# Altium project BSPD_Main.PrjPcb
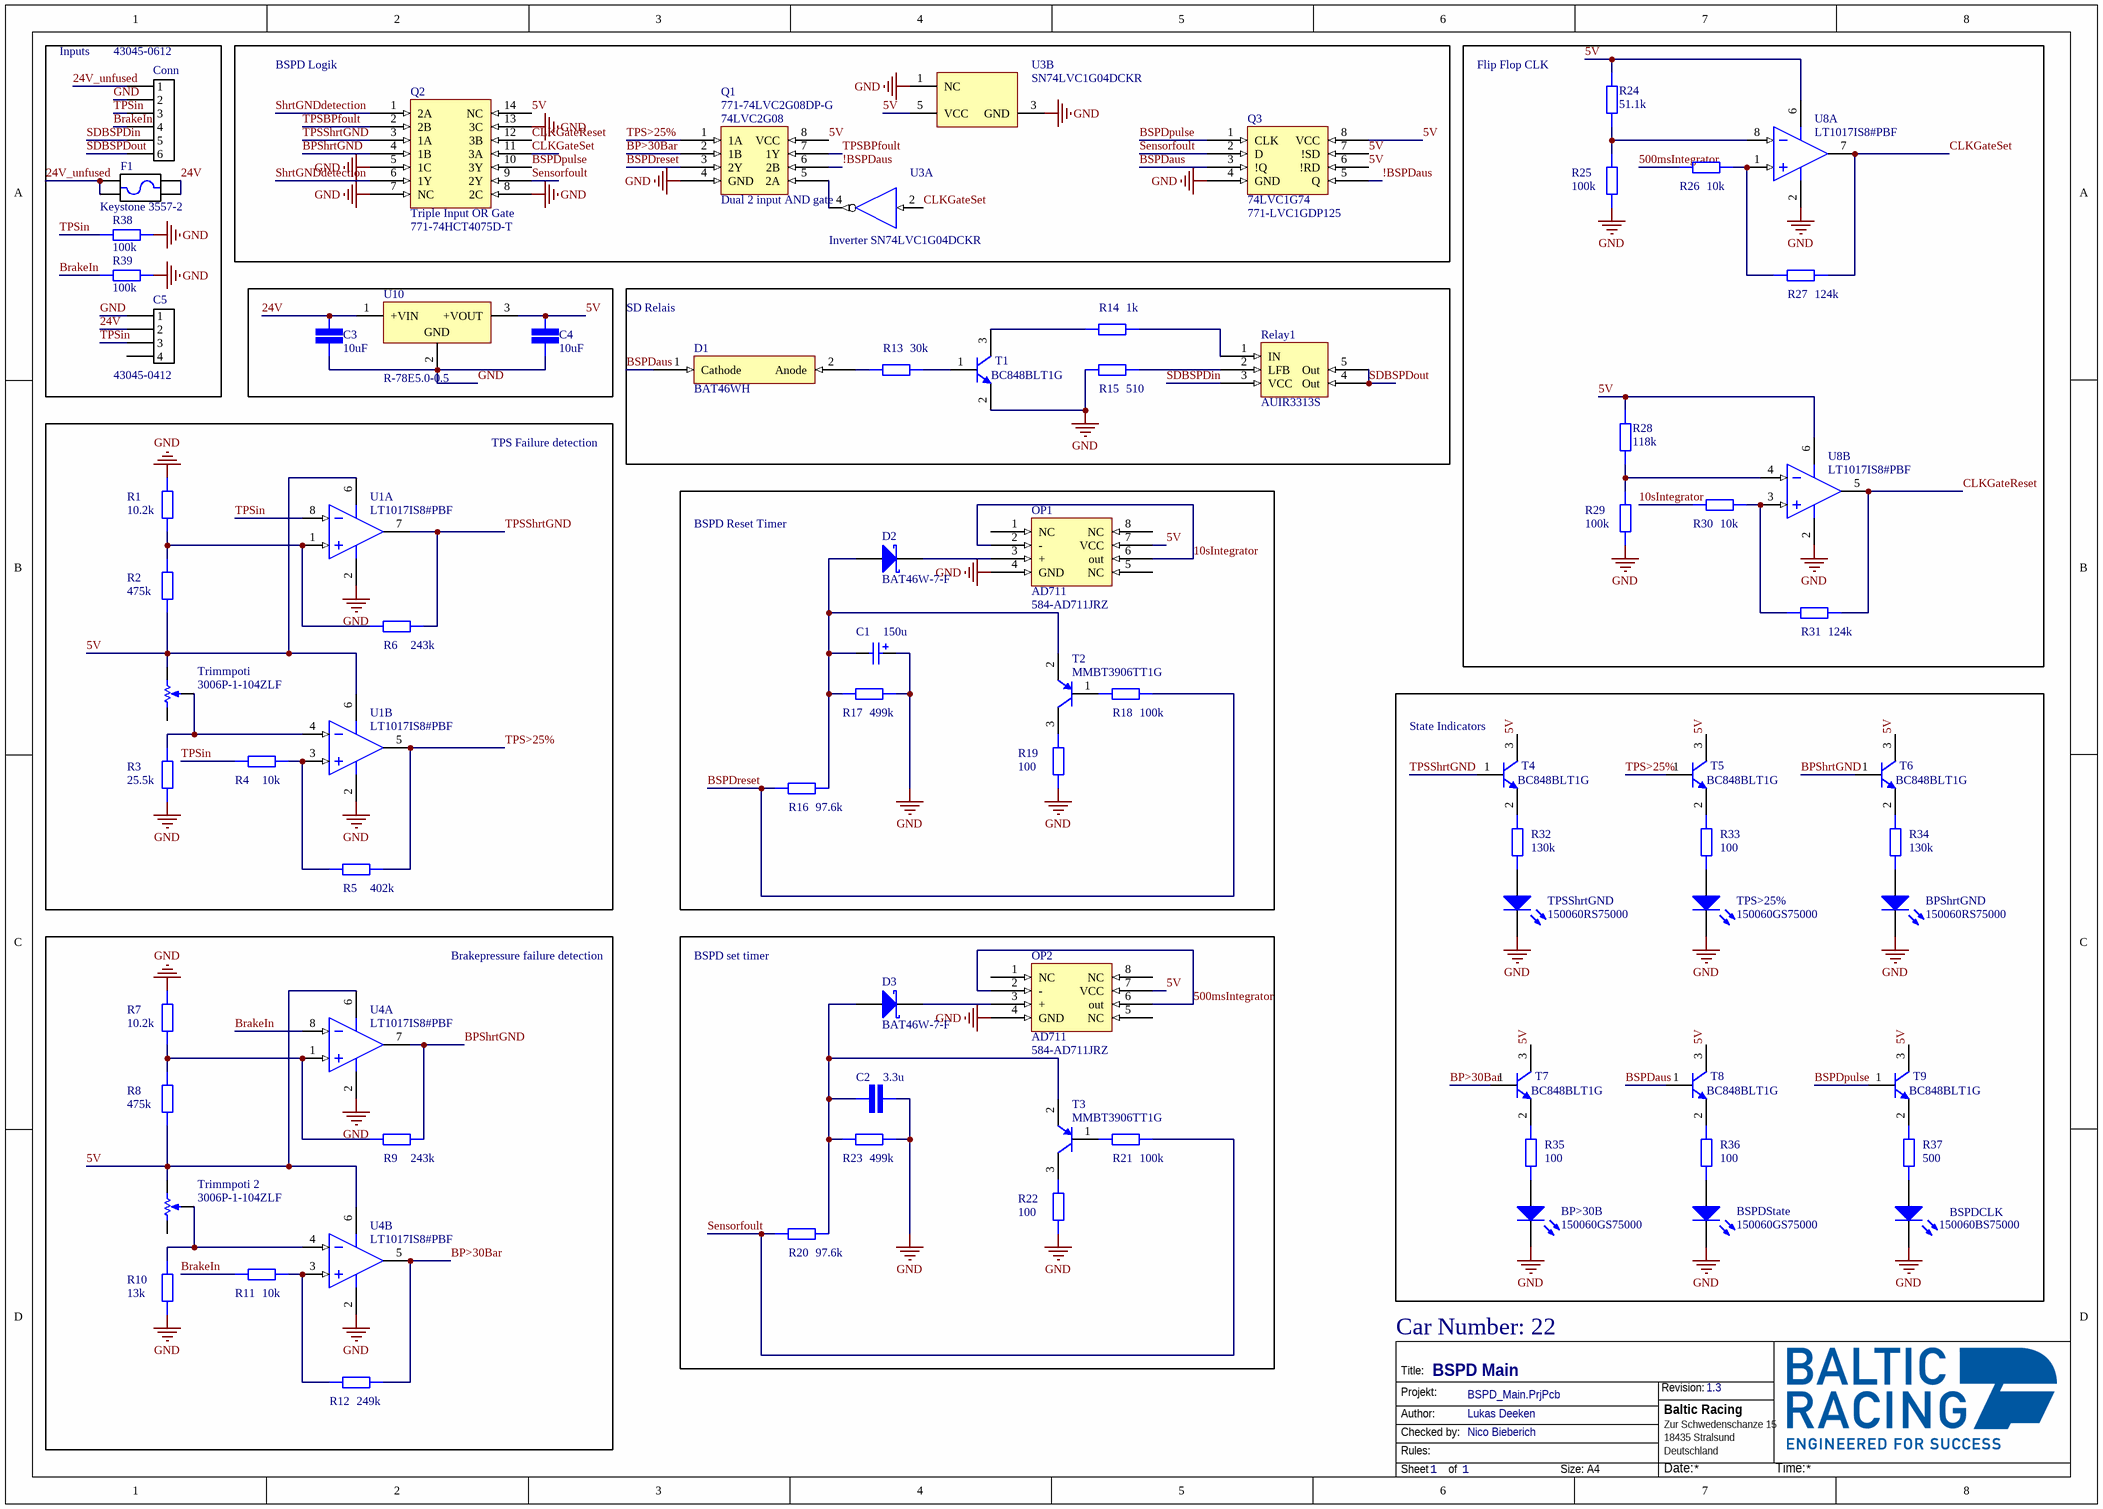
[diagram p0: SCH_BSPD_Main.SchDoc]
1 sheet, 77 parts. Net scope: global (net labels, ports and power ports of the same name join across sheets).
Board file: PCB_BSPD_Main.PcbDoc

## Sheet SCH_BSPD_Main.SchDoc: BSPD Main
size A3; Date: 25.03.2022; CheckedBy: Nico Bieberich; Author: Lukas Deeken; CompanyName: Baltic racing; DrawnBy: Lukas Deeken; Engineer: Lukas Deeken*; Organization: Baltic Racing; Address1: Zur Schwedenschanze 15; Address2: 18435 Stralsund; Address3: Deutschland; DocumentNumber: 1; Revision: 1.3; SheetNumber: 1; SheetTotal: 1

### Parts
BP>30B  150060GS75000  [0603_A]
BPShrtGND  150060RS75000  [0603_A]
BSPDCLK  150060BS75000  [0603_A]
BSPDState  150060GS75000  [0603_A]
C1  value 150u  [WCAP-PSLC_10x12.4]  (hidden comment: 875075561006)
C2  value 3.3u  [CAP 0603/1608]  (hidden comment: SMD Capacitor)
C3  value 10uF  [CAP 0805/2012]  (hidden comment: SMD Capacitor)
C4  value 10uF  [CAP 0805/2012]  (hidden comment: SMD Capacitor)
C5  43045-0412  [43045-0412]
Conn  43045-0612  [43045-0612]
D1  BAT46WH  [DIOM2715X18N]
D2  BAT46W-7-F  [DIOD-SOD-123-2_V]
D3  BAT46W-7-F  [DIOD-SOD-123-2_V]
F1  Keystone 3557-2  [Keystone 3557-2]
OP1  AD711  Supplier Part Number 1: 584-AD711JRZ  [SOIC8; SOIC127P600X175-8N]
OP2  AD711  Supplier Part Number 1: 584-AD711JRZ  [SOIC8; SOIC127P600X175-8N]
Q1  Dual 2 input AND gate  Supplier Part Number 1: 771-74LVC2G08DP-G  [TSSOP8; TSOP65P400X110-8N]
Q2  Triple Input OR Gate  Supplier Part Number 1: 771-74HCT4075D-T  [SOIC14; SOIC127P600X175-14N]
Q3  74LVC1G74  Supplier Part Number 1: 771-LVC1GDP125  [TSSOP8; TSOP65P400X110-8N]
R1  value 10.2k  [STACKPOLE CSR0603]  (hidden comment: SMD Resistor)
R2  value 475k  [STACKPOLE CSR0603]  (hidden comment: SMD Resistor)
R3  value 25.5k  [STACKPOLE CSR0603]  (hidden comment: SMD Resistor)
R4  value 10k  [STACKPOLE CSR0603]  (hidden comment: SMD Resistor)
R5  value 402k  [STACKPOLE CSR0603]  (hidden comment: SMD Resistor)
R6  value 243k  [STACKPOLE CSR0603]  (hidden comment: SMD Resistor)
R7  value 10.2k  [STACKPOLE CSR0603]  (hidden comment: SMD Resistor)
R8  value 475k  [STACKPOLE CSR0603]  (hidden comment: SMD Resistor)
R9  value 243k  [STACKPOLE CSR0603]  (hidden comment: SMD Resistor)
R10  value 13k  [STACKPOLE CSR0603]  (hidden comment: SMD Resistor)
R11  value 10k  [STACKPOLE CSR0603]  (hidden comment: SMD Resistor)
R12  value 249k  [STACKPOLE CSR0603]  (hidden comment: SMD Resistor)
R13  value 30k  [STACKPOLE CSR0603]  (hidden comment: SMD Resistor)
R14  value 1k  [STACKPOLE CSR0805]  (hidden comment: SMD Resistor)
R15  value 510  [STACKPOLE CSR0603]  (hidden comment: SMD Resistor)
R16  value 97.6k  [STACKPOLE CSR0603]  (hidden comment: SMD Resistor)
R17  value 499k  [STACKPOLE CSR0603]  (hidden comment: SMD Resistor)
R18  value 100k  [STACKPOLE CSR0603]  (hidden comment: SMD Resistor)
R19  value 100  [STACKPOLE CSR0805]  (hidden comment: SMD Resistor)
R20  value 97.6k  [STACKPOLE CSR0603]  (hidden comment: SMD Resistor)
R21  value 100k  [STACKPOLE CSR0603]  (hidden comment: SMD Resistor)
R22  value 100  [STACKPOLE CSR0805]  (hidden comment: SMD Resistor)
R23  value 499k  [STACKPOLE CSR0603]  (hidden comment: SMD Resistor)
R24  value 51.1k  [STACKPOLE CSR0603]  (hidden comment: SMD Resistor)
R25  value 100k  [STACKPOLE CSR0603]  (hidden comment: SMD Resistor)
R26  value 10k  [STACKPOLE CSR0603]  (hidden comment: SMD Resistor)
R27  value 124k  [STACKPOLE CSR0603]  (hidden comment: SMD Resistor)
R28  value 118k  [STACKPOLE CSR0603]  (hidden comment: SMD Resistor)
R29  value 100k  [STACKPOLE CSR0603]  (hidden comment: SMD Resistor)
R30  value 10k  [STACKPOLE CSR0603]  (hidden comment: SMD Resistor)
R31  value 124k  [STACKPOLE CSR0603]  (hidden comment: SMD Resistor)
R32  value 130k  [STACKPOLE CSR0603]  (hidden comment: SMD Resistor)
R33  value 100  [STACKPOLE CSR0603]  (hidden comment: SMD Resistor)
R34  value 130k  [STACKPOLE CSR0603]  (hidden comment: SMD Resistor)
R35  value 100  [STACKPOLE CSR0603]  (hidden comment: SMD Resistor)
R36  value 100  [STACKPOLE CSR0603]  (hidden comment: SMD Resistor)
R37  value 500  [STACKPOLE CSR0603]  (hidden comment: SMD Resistor)
R38  value 100k  [STACKPOLE CSR0603]  (hidden comment: SMD Resistor)
R39  value 100k  [STACKPOLE CSR0603]  (hidden comment: SMD Resistor)
Relay1  AUIR3313S  [D2PAK5 ;DPAK228P1524X483-5N]
T1  BC848BLT1G  [ONSC-SOT-23-3-318-08_V]
T2  MMBT3906TT1G  [ONSC-SC-75-3-463-01_V]
T3  MMBT3906TT1G  [ONSC-SC-75-3-463-01_V]
T4  BC848BLT1G  [ONSC-SOT-23-3-318-08_V]
T5  BC848BLT1G  [ONSC-SOT-23-3-318-08_V]
T6  BC848BLT1G  [ONSC-SOT-23-3-318-08_V]
T7  BC848BLT1G  [ONSC-SOT-23-3-318-08_V]
T8  BC848BLT1G  [ONSC-SOT-23-3-318-08_V]
T9  BC848BLT1G  [ONSC-SOT-23-3-318-08_V]
TPS>25%  150060GS75000  [0603_A]
TPSShrtGND  150060RS75000  [0603_A]
Trimmpoti  3006P-1-104ZLF  [BOUR-3006P-3_V]
Trimmpoti_2  3006P-1-104ZLF  [BOUR-3006P-3_V]
U1  LT1017IS8#PBF  [LT-S8_N]  (parts A,B of 2)
U3  Inverter SN74LVC1G04DCKR  [DCK0005A_N]  (parts A,B of 2)
U4  LT1017IS8#PBF  [LT-S8_N]  (parts A,B of 2)
U8  LT1017IS8#PBF  [LT-S8_N]  (parts A,B of 2)
U10  R-78E5.0-0.5  [REPO-R-78E-0.5-3_V]

### Blocks framed on the sheet
Inputs: C5 Conn F1 R38 R39
BSPD Logik: Q1-Q3 U3
Flip Flop CLK: R24-R31 U8
SD Relais: D1 R13-R15 Relay1 T1
TPS Failure detection: R1-R6 Trimmpoti U1
BSPD Reset Timer: C1 D2 OP1 R16-R19 T2
State Indicators: BP>30B BPShrtGND BSPDCLK BSPDState R32-R37 T4-T9 TPS>25% TPSShrtGND
Brakepressure failure detection: R7-R12 Trimmpoti_2 U4
BSPD set timer: C2 D3 OP2 R20-R23 T3

### Nets
GND: BP>30B.1(K) BPShrtGND.1(K) BSPDCLK.1(K) BSPDState.1(K) C1.1(P) C2.1 C3.1 C4.1 C5.1 Conn.2 OP1.4(GND) OP2.4(GND) Q1.4(GND) Q2.5(1C) Q2.7(NC) Q2.8(2C) Q2.13(3C) Q3.4(GND) R1.1 R3.2 R7.1 R10.2 R15.1 R17.2 R19.1 R22.1 R23.2 R25.2 R29.2 R38.2 R39.2 T1.2(E) TPS>25%.1(K) TPSShrtGND.1(K) U1.2(V-) U3.1(NC) U3.3(GND) U4.2(V-) U8.2(V-) U10.2(GND)
5V: C4.2 OP1.7(VCC) OP2.7(VCC) Q1.8(VCC) Q2.14(NC) Q3.6(!RD) Q3.7(!SD) Q3.8(VCC) R2.2 R8.2 R24.2 R28.2 T4.3(C) T5.3(C) T6.3(C) T7.3(C) T8.3(C) T9.3(C) Trimmpoti.1(CCW) Trimmpoti_2.1(CCW) U1.6(V+) U3.5(VCC) U4.6(V+) U8.6(V+) U10.3(+VOUT)
10sIntegrator: OP1.2(-) OP1.6(out) R30.2
24V: C3.2 C5.2 F1.O1 F1.O2 U10.1(+VIN)
24V_unfused: Conn.1 F1.I1 F1.I2
500msIntegrator: OP2.2(-) OP2.6(out) R26.2
!BSPDaus: Q1.6(2B) Q3.5(Q)
BP>30Bar: Q1.2(1B) R12.2 T7.1(B) U4.5(OUT_B)
BPShrtGND: Q2.4(1B) R9.1 T6.1(B) U4.7(OUT_A)
BrakeIn: Conn.4 R11.2 R39.1 U4.8(-IN_A)
BSPDaus: D1.1(Cathode) Q3.3(!Q) T8.1(B)
BSPDpulse: Q2.10(3Y) Q3.1(CLK) T9.1(B)
BSPDreset: Q1.3(2Y) R16.1 R18.2
CLKGateReset: Q2.12(3B) R31.2 U8.5(OUT_B)
CLKGateSet: Q2.11(3A) R27.2 U3.2(A) U8.7(OUT_A)
SDBSPDin: Conn.5 Relay1.3(VCC)
SDBSPDout: Conn.6 Relay1.4(Out) Relay1.5(Out)
Sensorfoult: Q2.9(2Y) Q3.2(D) R20.1 R21.2
ShrtGNDdetection: Q2.1(2A) Q2.6(1Y)
TPS>25%: Q1.1(1A) R5.1 T5.1(B) U1.5(OUT_B)
TPSBPfoult: Q1.7(1Y) Q2.2(2B)
TPSin: C5.3 Conn.3 R4.2 R38.1 U1.8(-IN_A)
TPSShrtGND: Q2.3(1A) R6.1 T4.1(B) U1.7(OUT_A)
NetBP>30B_2: BP>30B.2(A) R35.1
NetBPShrtGND_2: BPShrtGND.2(A) R34.1
NetBSPDCLK_2: BSPDCLK.2(A) R37.1
NetBSPDState_2: BSPDState.2(A) R36.1
NetC1_2: C1.2(N) D2.1(A) R16.2 R17.1 T2.2(E)
NetC2_2: C2.2 D3.1(A) R20.2 R23.1 T3.2(E)
NetD1_2: D1.2(Anode) R13.1
NetD2_2: D2.2(K) OP1.3(+)
NetD3_2: D3.2(K) OP2.3(+)
NetQ1_5: Q1.5(2A) U3.4(Y)
NetR1_2: R1.2 R2.1 R6.2 U1.1(+IN_A)
NetR3_1: R3.1 Trimmpoti.2(WIPER) U1.4(-IN_B)
NetR4_1: R4.1 R5.2 U1.3(+IN_B)
NetR7_2: R7.2 R8.1 R9.2 U4.1(+IN_A)
NetR10_1: R10.1 Trimmpoti_2.2(WIPER) U4.4(-IN_B)
NetR11_1: R11.1 R12.1 U4.3(+IN_B)
NetR13_2: R13.2 T1.1(B)
NetR14_1: R14.1 T1.3(C)
NetR14_2: R14.2 Relay1.1(IN)
NetR15_2: R15.2 Relay1.2(LFB)
NetR18_1: R18.1 T2.1(B)
NetR19_2: R19.2 T2.3(C)
NetR21_1: R21.1 T3.1(B)
NetR22_2: R22.2 T3.3(C)
NetR24_1: R24.1 R25.1 U8.8(-IN_A)
NetR26_1: R26.1 R27.1 U8.1(+IN_A)
NetR28_1: R28.1 R29.1 U8.4(-IN_B)
NetR30_1: R30.1 R31.1 U8.3(+IN_B)
NetR32_1: R32.1 TPSShrtGND.2(A)
NetR32_2: R32.2 T4.2(E)
NetR33_1: R33.1 TPS>25%.2(A)
NetR33_2: R33.2 T5.2(E)
NetR34_2: R34.2 T6.2(E)
NetR35_2: R35.2 T7.2(E)
NetR36_2: R36.2 T8.2(E)
NetR37_2: R37.2 T9.2(E)

Not connected (* = marked no-connect by the designer): C5 4; OP1 1(NC) 5(NC) 8(NC); OP2 1(NC) 5(NC) 8(NC); Trimmpoti 3(CW); Trimmpoti_2 3(CW)

### Notes on the sheet
- Car Number: 22
- Title:
- Projekt:
- Revision:
- Author:
- Rules:
- Checked by:
- Sheet
- of
- Size:
- A4
- Date:
- Time:
- (in symbol 74LVC2G08-Q100) 74LVC2G08

### Library data of the parts
BP>30B BSPDState TPS>25% = CMP-1426-00002-1: SMD mono-color Chip LED, WL-SMCW, Green; Manufacturer: Wuerth Elektronik; ComponentLink1URL: http://www.we-online.com; ComponentLink2Description: Datasheet; Color: Green; ComponentLink2URL: http://katalog.we-online.com/led/datasheet/150060GS75000.pdf; PartNumber: 150060GS75000; PackageReference: 0603_A; ComponentLink1Description: Manufacturer URL
BPShrtGND TPSShrtGND = CMP-1426-00001-1: SMD mono-color Chip LED, WL-SMCW, Red; Manufacturer: Wuerth Elektronik; Color: Red; PackageReference: 0603_A; ComponentLink2URL: http://katalog.we-online.com/led/datasheet/150060RS75000.pdf; ComponentLink1URL: http://www.we-online.com; ComponentLink1Description: Manufacturer URL; ComponentLink2Description: Datasheet; PartNumber: 150060RS75000
BSPDCLK = CMP-1426-00003-1: SMD mono-color Chip LED, WL-SMCW, Blue; Manufacturer: Wuerth Elektronik; Color: Blue; ComponentLink2Description: Datasheet; ComponentLink2URL: http://katalog.we-online.com/led/datasheet/150060BS75000.pdf; ComponentLink1URL: http://www.we-online.com; PackageReference: 0603_A; PartNumber: 150060BS75000; ComponentLink1Description: Manufacturer URL
C1 = 875075561006: WCAP-PSLC Aluminum Polymer Capacitors, size Ф10x12.4mm, 25V DC, 150uF; Rated Voltage: 25V DC; ComponentLink1Description: Manufacturer; ComponentLink1URL: http://www.we-online.de; ComponentLink2Description: Datasheet; ComponentLink2URL: http://katalog.we-online.de/pbs/datasheet/875075561006.pdf; Part Number: 875075561006; Published Date: June 2017; Publisher: Wurth Elektronik; Size: Ф10x12.4mm; Life Cycle: 2000h; Operating Temperature: -55 °C up to +105 °C
C2 C4 = SMD Capacitor: Capacitor with multiple Footprints; Voltage: 6.3V
C3 = SMD Capacitor: Capacitor with multiple Footprints; Voltage: 25V
C5 = MicroFit3.0 4-Pin: Molex Micro-Fit 3.0 4-Pin / 600V / 8.5A
Conn = MicroFit3.0 6-Pin: Molex Micro-Fit 3.0 6-Pin / 600V / 8.5A
D2 D3 = CMP-0303-00004-1: Surface Mount Schottky Barrier Diode, 100 V, -55 to 125 degC, 2-Pin SOD123, RoHS, Tape and Reel; Manufacturer: Diodes Inc; IR@1.5 V: 0.3 uA Max.; V(BR)R: 100 V Min.; VF@10 mA: 0.45 V Max.; CT@1 V: 12 pF Typ.; PartNumber: BAT46W-7-F; ComponentLink1URL: http://www.diodes.com/; ComponentLink3URL: http://diodes.com/datasheets/ds30044.pdf; PackageDescription: 2-Pin SMD, Body 2.7 x 1.55 mm, Height 1.45 mm; ComponentLink2Description: Datasheet; ComponentLink3Description: Package Specification; Mounting Technology: Surface Mount; ComponentLink1Description: Manufacturer URL; RoHS: TRUE; Operating Temperature: -55 to 125 degC; Packing: Tape and Reel; ComponentLink2URL: http://diodes.com/datasheets/ds30044.pdf; DatasheetVersion: Rev. 16-2
F1 = Keystone 3557-2: Keystone 3557-2 / Fuse Holder; ComponentLink1Description: Octopart; ComponentLink1URL: https://octopart.com/3557-2-keystone-850400?r=sp
Q1 = 74LVC2G08-Q100: Supplier 1: Mouser
Q2 = 74HCT4075D,653: Supplier 1: Mouser
R1-R39 = SMD Resistor: Resistor with multiple footprints
T1 T4-T9 = CMP-1048-00679-1: General Purpose Transistor, NPN Silicon, 3-Pin SOT-23, Pb-Free, Tape and Reel; Manufacturer: On Semiconductor; fT Min (MHz): 100; IC Continuous (A): 0.1; DatasheetVersion: Rev. 11; PackageVersion: Rev. AP, 11/2009; RoHS: TRUE; PartNumber: BC848BLT1G; ComponentLink1Description: Manufacturer URL; PackageReference: SOT-23-3-318-08; ComponentLink3Description: Package Specification; ComponentLink1URL: http://www.onsemi.com/; Polarity: NPN; ComponentLink2Description: Datasheet; ComponentLink2URL: http://www.onsemi.cn/pub_link/Collateral/BC846ALT1-D.PDF; ComponentLink3URL: http://www.onsemi.cn/pub_link/Collateral/318-08.PDF; PackageDescription: 3-Pin Small Outline Transistor, Body 2.92 x 1.3 mm, Pitch 0.95 mm; Packing: Tape and Reel; Mounting Technology: Surface Mount
T2 T3 = CMP-1048-00413-1: General Purpose Transistor, PNP Silicon, 3-Pin SC-75, Pb-Free, Tape and Reel; Manufacturer: On Semiconductor; fT Min (MHz): 250; IC Continuous (A): -0.2; ComponentLink1URL: http://www.onsemi.com/; ComponentLink3Description: Package Specification; PackageDescription: 3-Pin Small Outline Transistor, Body 1.6 x 0.8 mm, Pitch 0.5 mm; ComponentLink1Description: Manufacturer URL; ComponentLink2Description: Datasheet; RoHS: TRUE; Packing: Tape and Reel; PackageVersion: Rev. F, 07/2005; PartNumber: MMBT3906TT1G; ComponentLink3URL: http://www.onsemi.com/pub_link/Collateral/463-01.PDF; PackageReference: SC-75-3-463-01; Mounting Technology: Surface Mount; Polarity: PNP; DatasheetVersion: Rev. 1; ComponentLink2URL: http://www.onsemi.cn/pub_link/Collateral/MMBT3906TT1-D.PDF
Trimmpoti Trimmpoti_2 = CMP-0975-00010-1: Trimming Potentiometer, 100K Ohm +/- 10%, -55 to 125 degC, 3-Pin 19.05 x 4.83 x 6.6 mm THD, RoHS; Manufacturer: Bourns; Rotational Life: 200 Cycles; Resistance Tolerance: +/- 10%; Resistance (kOhm): 100; Number of Turns: 15; ComponentLink1Description: Manufacturer URL; ComponentLink1URL: http://www.bourns.com/; ComponentLink2URL: http://www.bourns.com/data/global/pdfs/3006.pdf; DatasheetVersion: Apr-14; PartNumber: 3006P-1-104ZLF; ComponentLink3URL: http://www.bourns.com/data/global/pdfs/3006.pdf; PackageDescription: 3-Pin THD, Body 19.05 x 4.83 mm, Height 6.6 mm; Temperature Range: -55 to 125 degC; ComponentLink3Description: Package Specification; RoHS: TRUE; ComponentLink2Description: Datasheet; PackageReference: 3006P-3; PackageVersion: Apr-14; Mounting Technology: Through Hole
U1 U4 U8 = CMP-0360-00547-2: Micropower Comparator, 2 Channels, 1.2 to 40 V, -40 to +85 degC, 8-pin SOP (S8); Manufacturer: Linear Technology; Generic Part Number: LT1017; Prop Delay (us): 22; Vos (mV) Typical: 0.4; Vs Max (V): 40; Vos (mV) Guaranteed: 1; Supply Current (uA) Guaranteed: 60; Vs Min (V): 1.2; Supply Current (uA) Typical: 30; Channels (#): 2; Features: Comparator; ComponentLink1Description: Manufacturer URL; ComponentLink2Description: Datasheet; PackageDescription: 8-Pin Plastic Small Outline (Narrow .150 Inch), Body 4.9 x 3.9 mm, Pitch 1.27 mm; ComponentLink1URL: http://www.linear.com/; PartNumber: LT1017IS8#PBF; RoHS: Y; Mounting Technology: Surface Mount; DatasheetVersion: Rev F; PackageReference: S8; ComponentLink3Description: Package Specification; ComponentLink3URL: http://cds.linear.com/docs/en/packaging/05081610_G_SO8.pdf; ComponentLink2URL: http://cds.linear.com/docs/en/datasheet/10178ff.pdf; Supply Voltage Range: 1.2 to 40 V
U3 = CMP-0859-00252-3: Single Inverter, DCK0005A, LARGE T&R; Manufacturer: Texas Instruments; Input Type: CMOS/TTL; Output Drive (IOL/IOH)(Max)(mA): 32/-32; Sub-Family: Inverting Buffer/Driver; VCC(Min)(V): 1.65; Bits(#): 1; Schmitt Trigger: No; Technology Family: LVC; Rating: Catalog; ICC @ Nom Voltage(Max)(mA): 0.01; tpd @ Nom Voltage(Max)(ns): 7.5,5.2,4.2,3.7; Voltage(Nom)(V): 1.8,2.5,3.3,5; F @ Nom Voltage(Max)(Mhz): 150; Output Type: CMOS; VCC(Max)(V): 5.5; Logic: Inverting; PackageReference: DCK0005A; Generic Part Number: SN74LVC1G04; Operating Temperature Range(C): -40 to 125,-40 to 85; DatasheetVersion: SCES214AD; 3-State Output: No
U10 = CMP-2000-06922-2: DC/DC-Converter, 5 V Single Output, 500 mA, -40 to 85 degC, 3-Pin THD, RoHS, Tube; Manufacturer: Recom Power; Efficiency: 92%; Number of Outputs: 1; Current - Output (Max): 500mA; VIN Min: 7V; Package Version: Rev. 0; VIN Max: 28V; VOUT: 5V; Manufacturer URL: http://www.recom-power.com/us/americas/home.html; Operating Temperature: -40°C~85°C; Datasheet Version: 01/2017; Packaging: Tube; Package Reference: SIP Module; Datasheet URL: http://www.recom-power.com/pdf/Innoline/R-78Exx-0.5.pdf; Package Description: 3-Pin Through Hole Device, Body 11.6 x 8.5 mm, Pitch 2.54 mm; Mounting Technology: ThroughHole
OP1 OP2 = AD711: Supplier 1: Mouser
Q3 = 74LVC1G74: Supplier 1: Mouser